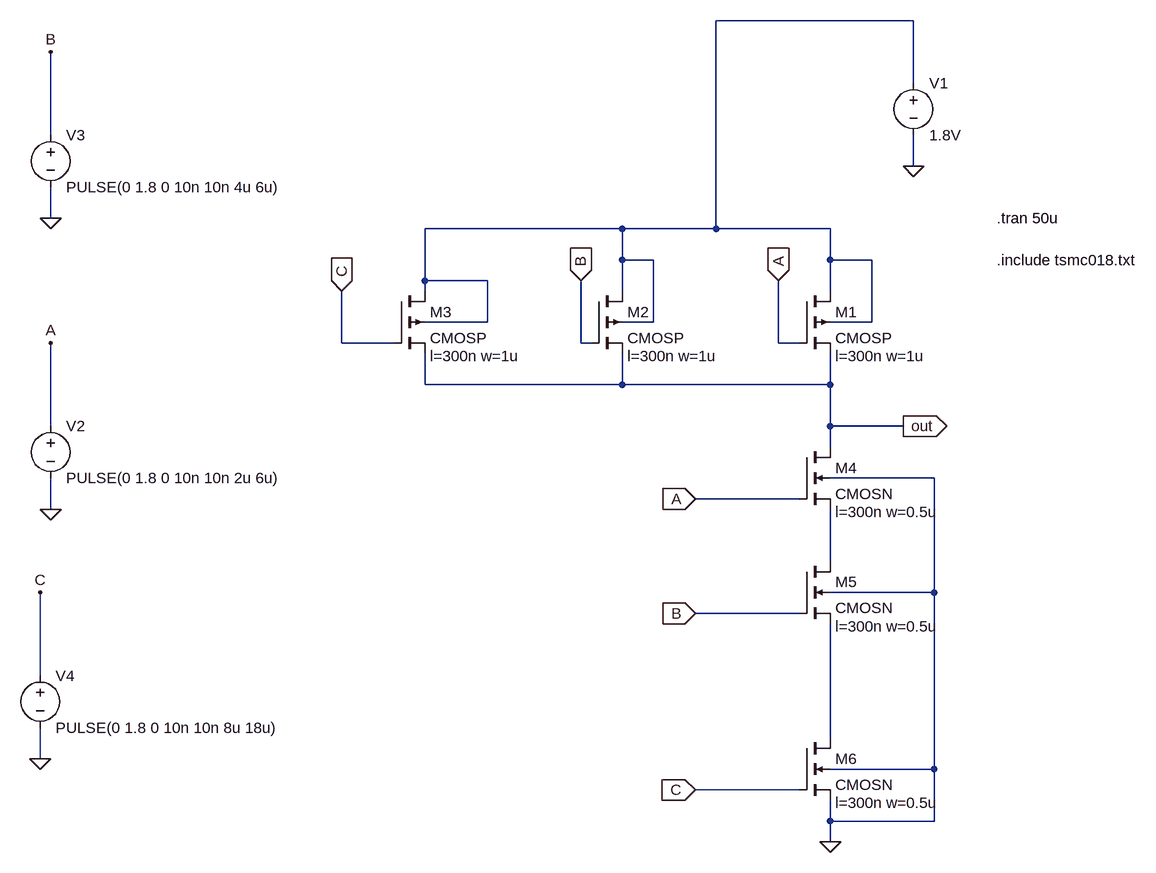
[diagram p0: schematic NAND_3 input.asc]
NAND_3 input.asc, the LTspice schematic file:
Version 4
SHEET 1 880 952
WIRE 304 -336 0 -336
WIRE 304 -240 304 -336
WIRE -1024 -160 -1024 -288
WIRE 304 -112 304 -160
WIRE -1024 -32 -1024 -80
WIRE -144 -16 -448 -16
WIRE 0 -16 0 -336
WIRE 0 -16 -144 -16
WIRE 176 -16 0 -16
WIRE -144 32 -144 -16
WIRE -96 32 -144 32
WIRE 176 32 176 -16
WIRE 240 32 176 32
WIRE -448 64 -448 -16
WIRE -352 64 -448 64
WIRE -448 80 -448 64
WIRE -144 80 -144 32
WIRE 176 80 176 32
WIRE -352 128 -352 64
WIRE -352 128 -448 128
WIRE -96 128 -96 32
WIRE -96 128 -144 128
WIRE 240 128 240 32
WIRE 240 128 176 128
WIRE -576 160 -576 80
WIRE -496 160 -576 160
WIRE -208 160 -208 64
WIRE -192 160 -208 160
WIRE 96 160 96 64
WIRE 128 160 96 160
WIRE -448 224 -448 176
WIRE -144 224 -144 176
WIRE -144 224 -448 224
WIRE 176 224 176 176
WIRE 176 224 -144 224
WIRE -1024 288 -1024 160
WIRE 176 288 176 224
WIRE 288 288 176 288
WIRE 176 320 176 288
WIRE 336 368 176 368
WIRE 128 400 -32 400
WIRE -1024 416 -1024 368
WIRE 176 496 176 416
WIRE 336 544 336 368
WIRE 336 544 176 544
WIRE 128 576 -32 576
WIRE -1040 672 -1040 544
WIRE 176 768 176 592
WIRE -1040 800 -1040 752
WIRE 336 816 336 544
WIRE 336 816 176 816
WIRE 128 848 -32 848
WIRE 176 896 176 864
WIRE 336 896 336 816
WIRE 336 896 176 896
WIRE 176 928 176 896
FLAG 96 64 A
IOPIN 96 64 In
FLAG -32 400 A
IOPIN -32 400 In
FLAG -208 64 B
IOPIN -208 64 In
FLAG -32 576 B
IOPIN -32 576 In
FLAG 288 288 out
IOPIN 288 288 Out
FLAG 304 -112 0
FLAG -1024 416 0
FLAG -1024 160 A
FLAG -1024 -32 0
FLAG -1024 -288 B
FLAG 176 928 0
FLAG -32 848 C
IOPIN -32 848 In
FLAG -576 80 C
IOPIN -576 80 In
FLAG -1040 800 0
FLAG -1040 544 C
SYMBOL pmos4 128 80 R0
WINDOW 123 56 100 Left 2
SYMATTR Value2 l=300n w=1u
SYMATTR InstName M1
SYMATTR Value CMOSP
SYMBOL pmos4 -192 80 R0
WINDOW 123 56 100 Left 2
SYMATTR Value2 l=300n w=1u
SYMATTR InstName M2
SYMATTR Value CMOSP
SYMBOL nmos4 128 320 R0
WINDOW 123 56 100 Left 2
SYMATTR Value2 l=300n w=0.5u
SYMATTR InstName M4
SYMATTR Value CMOSN
SYMBOL nmos4 128 496 R0
WINDOW 123 56 100 Left 2
SYMATTR Value2 l=300n w=0.5u
SYMATTR InstName M5
SYMATTR Value CMOSN
SYMBOL voltage 304 -256 R0
WINDOW 123 0 0 Left 0
WINDOW 39 0 0 Left 0
SYMATTR InstName V1
SYMATTR Value 1.8V
SYMBOL voltage -1024 272 R0
WINDOW 123 0 0 Left 0
WINDOW 39 0 0 Left 0
SYMATTR InstName V2
SYMATTR Value PULSE(0 1.8 0 10n 10n 2u 6u)
SYMBOL voltage -1024 -176 R0
WINDOW 123 0 0 Left 0
WINDOW 39 0 0 Left 0
SYMATTR InstName V3
SYMATTR Value PULSE(0 1.8 0 10n 10n 4u 6u)
SYMBOL pmos4 -496 80 R0
WINDOW 123 56 100 Left 2
SYMATTR Value2 l=300n w=1u
SYMATTR InstName M3
SYMATTR Value CMOSP
SYMBOL nmos4 128 768 R0
WINDOW 123 56 100 Left 2
SYMATTR Value2 l=300n w=0.5u
SYMATTR InstName M6
SYMATTR Value CMOSN
SYMBOL voltage -1040 656 R0
WINDOW 123 0 0 Left 0
WINDOW 39 0 0 Left 0
SYMATTR InstName V4
SYMATTR Value PULSE(0 1.8 0 10n 10n 8u 18u)
TEXT 432 32 Left 2 !.include tsmc018.txt
TEXT 432 -32 Left 2 !.tran 50u

The netlist it stands for:
* NAND_3 input.asc
M1 N001 A out N001 CMOSP l=300n w=1u
M2 N001 B out N001 CMOSP l=300n w=1u
M4 out A N002 0 CMOSN l=300n w=0.5u
M5 N002 B N003 0 CMOSN l=300n w=0.5u
V1 N001 0 1.8V
V2 A 0 PULSE(0 1.8 0 10n 10n 2u 6u)
V3 B 0 PULSE(0 1.8 0 10n 10n 4u 6u)
M3 N001 C out N001 CMOSP l=300n w=1u
M6 N003 C 0 0 CMOSN l=300n w=0.5u
V4 C 0 PULSE(0 1.8 0 10n 10n 8u 18u)
.model NMOS NMOS
.model PMOS PMOS
.lib standard.mos
.include tsmc018.txt
.tran 50u
.backanno
.end